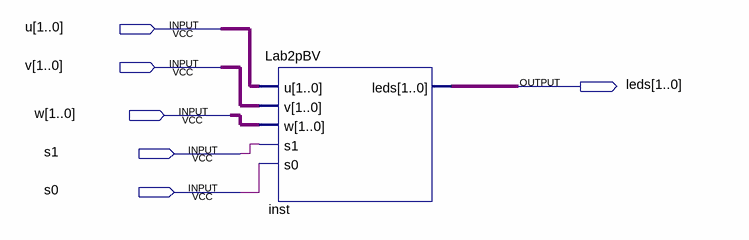
[diagram p0: schematic sheet]
// Quartus schematic Lab2pB.bdf as structural Verilog: 1 symbols, 6 pins
module Lab2pB (
  input  [1:0] u,
  input  [1:0] v,
  input  [1:0] w,
  input  s1,
  input  s0,
  output [1:0] leds
);

  Lab2pBV inst (.u(u), .v(v), .w(w), .s1(s1), .s0(s0), .leds(leds));
endmodule
